# EAGLE design controller-ha-v5 (EAGLE 6.5.0)
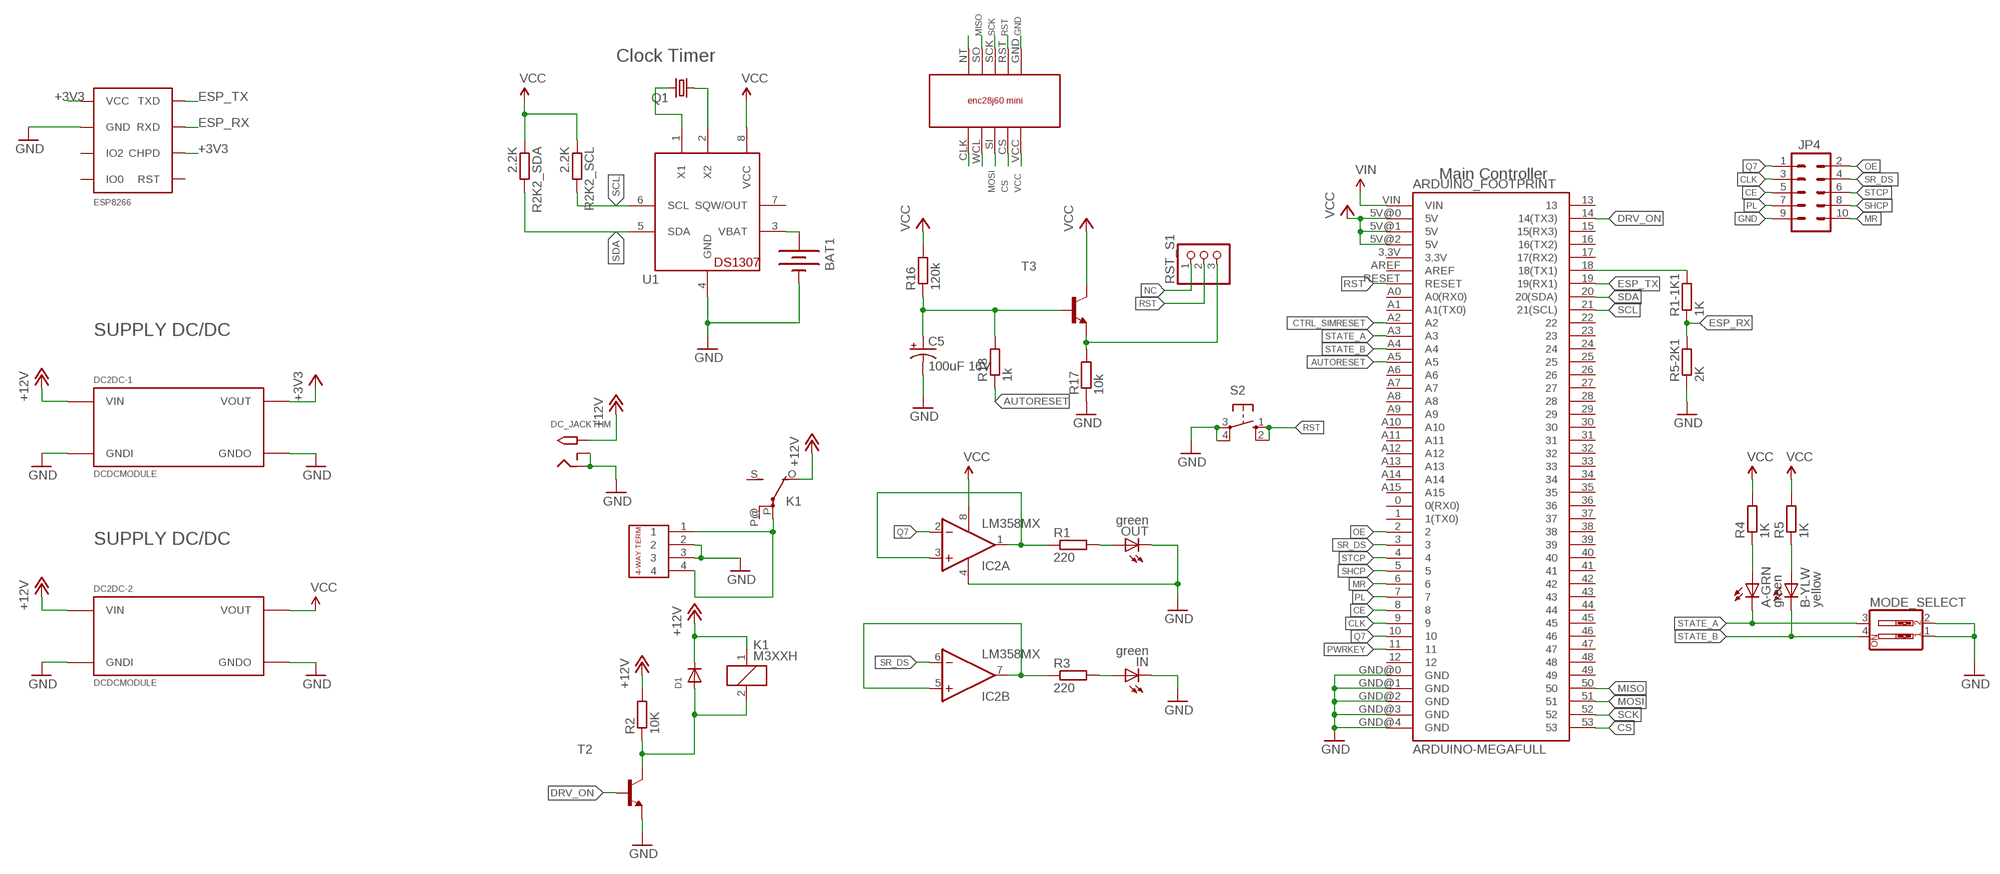
[diagram p0: schematic, sheet 1]

## Parts
4-WAY_L-TERMINAL  4-PIN-CON-1759017  [4-PIN-CON-1759017]
A-GRN  green  LEDCHIP-LED0805  [CHIP-LED0805]
ARDUINO_FOOTPRINT  ARDUINO-MEGAFULL  [ARDUINO_MEGA]
B-YLW  yellow  LEDCHIP-LED0805  [CHIP-LED0805]
BAT1  BATTERY20PTH  [BATTCOM_20MM_PTH]
C5  100uF 16V  CPOL-US153CLV-0605  [153CLV-0605]
D1  DIODESMA  [SMADIODE]
DC2DC-1  DCDCMODULE  [DCDCMODULE]
DC2DC-2  DCDCMODULE  [DCDCMODULE]
DC_JACKTHM  2.1MMJACKTHM  [PJ-102A]
ESP8266  ESP8266  [ESP8266]
IC2  LM358MX  [SO08]
IN  green  LEDCHIPLED_0805  [CHIPLED_0805]
JP4  M05X2RA  [2X5-RA]
K1  M3XXH  [M3XXH]
MODE_SELECT  SW_DIP-2  [EDG-02]
OUT  green  LEDCHIPLED_0805  [CHIPLED_0805]
Q1  CRYSTALTC26H  [TC26H]
R1  220  R-EU_R0805  [R0805]
R1-1K1  1K  R-EU_R0603  [R0603]
R2  10K  R-EU_R0805  [R0805]
R2K2_SCL  2.2K  R-EU_R0603  [R0603]
R2K2_SDA  2.2K  R-EU_R0603  [R0603]
R3  220  R-EU_R0805  [R0805]
R4  1K  R-EU_R0805  [R0805]
R5  1K  R-EU_R0805  [R0805]
R5-2K1  2K  R-EU_R0603  [R0603]
R16  120k  R-EU_R0805  [R0805]
R17  10k  R-EU_R0805  [R0805]
R18  1k  R-EU_R0805  [R0805]
RST_S1  PINHD-1X3CB  [1X03-CLEANBIG]
S2  10-XX  [B3F-10XX]
T2  MMBT2222ALT1-NPN-SOT23-BEC  [SOT23-BEC]
T3  MMBT2222ALT1-NPN-SOT23-BEC  [SOT23-BEC]
U1  DS1307  [DIL08]
U$2  ENC28J60_MODULE_BOTTOM  [ENC28J60_MODULE_BOTTOM]

## Nets
+3V3 [power]: DC2DC-1.VOUT ESP8266.CHPD ESP8266.VCC
+12V [power]: D1.C DC2DC-1.VIN DC2DC-2.VIN DC_JACKTHM.TIP K1.1 K1.O(2:O) R2.2
AUTORESET: ARDUINO_FOOTPRINT.A5 R18.1
CE: ARDUINO_FOOTPRINT.8 JP4.5
CLK: ARDUINO_FOOTPRINT.9 JP4.3
CS: ARDUINO_FOOTPRINT.53 U$2.CS
CTRL_SIMRESET: ARDUINO_FOOTPRINT.A2
DRV_ON: ARDUINO_FOOTPRINT.14(14(TX3)) T2.B
ESP_RX: ESP8266.RXD R1-1K1.1 R5-2K1.2
ESP_TX: ARDUINO_FOOTPRINT.19(19(RX1)) ESP8266.TXD
GND [GND]: 4-WAY_L-TERMINAL.2 4-WAY_L-TERMINAL.3 ARDUINO_FOOTPRINT.GND@0(GND) ARDUINO_FOOTPRINT.GND@1(GND) ARDUINO_FOOTPRINT.GND@2(GND) ARDUINO_FOOTPRINT.GND@3(GND) ARDUINO_FOOTPRINT.GND@4(GND) BAT1.2(-) C5.- DC2DC-1.GND#0(GNDI) DC2DC-1.GND#1(GNDO) DC2DC-2.GND#0(GNDI) DC2DC-2.GND#1(GNDO) DC_JACKTHM.RING DC_JACKTHM.RING_SW ESP8266.GND IC2.4(P:V-) IN.C JP4.9 MODE_SELECT.1 MODE_SELECT.2 OUT.C R5-2K1.1 R17.1 S2.3(P) S2.4(P1) T2.E U1.4(GND) U$2.GND
MISO: ARDUINO_FOOTPRINT.50 U$2.SO
MOSI: ARDUINO_FOOTPRINT.51 U$2.SI
MR: ARDUINO_FOOTPRINT.6 JP4.10
N$1: U$2.CLK
N$2: U$2.WCL
N$3: 4-WAY_L-TERMINAL.1 4-WAY_L-TERMINAL.4 K1.P(2:P)
N$4: D1.A K1.2 R2.1 T2.C
N$5: R17.2 RST_S1.3 T3.E
N$16: Q1.1 U1.2(X2)
N$19: Q1.2 U1.1(X1)
N$20: ARDUINO_FOOTPRINT.18(18(TX1)) R1-1K1.2
N$21: IC2.1(A:OUT) IC2.3(A:+IN) R1.1
N$23: BAT1.1(+) U1.3(VBAT)
N$24: IC2.5(B:+IN) IC2.7(B:OUT) R3.1
N$25: OUT.A R1.2
N$26: IN.A R3.2
N$27: A-GRN.A R4.1
N$28: B-YLW.A R5.1
N$35: U$2.NT
NC: RST_S1.1
NET1: C5.+ R16.1 R18.2 T3.B
OE: ARDUINO_FOOTPRINT.2 JP4.2
PL: ARDUINO_FOOTPRINT.7 JP4.7
PWRKEY: ARDUINO_FOOTPRINT.11
Q7: ARDUINO_FOOTPRINT.10 IC2.2(A:-IN) JP4.1
RST: ARDUINO_FOOTPRINT.RESET RST_S1.2 S2.1(S) S2.2(S1) U$2.RST
SCK: ARDUINO_FOOTPRINT.52 U$2.SCK
SCL: ARDUINO_FOOTPRINT.21(21(SCL)) R2K2_SCL.2 U1.6(SCL)
SDA: ARDUINO_FOOTPRINT.20(20(SDA)) R2K2_SDA.2 U1.5(SDA)
SHCP: ARDUINO_FOOTPRINT.5 JP4.8
SR_DS: ARDUINO_FOOTPRINT.3 IC2.6(B:-IN) JP4.4
STATE_A: A-GRN.C ARDUINO_FOOTPRINT.A3 MODE_SELECT.3
STATE_B: ARDUINO_FOOTPRINT.A4 B-YLW.C MODE_SELECT.4
STCP: ARDUINO_FOOTPRINT.4 JP4.6
VCC [power]: ARDUINO_FOOTPRINT.5V@0(5V) ARDUINO_FOOTPRINT.5V@1(5V) ARDUINO_FOOTPRINT.5V@2(5V) DC2DC-2.VOUT IC2.8(P:V+) R2K2_SCL.1 R2K2_SDA.1 R4.2 R5.2 R16.2 T3.C U1.8(VCC) U$2.VCC
VIN: ARDUINO_FOOTPRINT.VIN
Unconnected: ARDUINO_FOOTPRINT.0(0(RX0)) ARDUINO_FOOTPRINT.1(1(TX0)) ARDUINO_FOOTPRINT.3.3V ARDUINO_FOOTPRINT.12 ARDUINO_FOOTPRINT.13 ARDUINO_FOOTPRINT.15(15(RX3)) ARDUINO_FOOTPRINT.16(16(TX2)) ARDUINO_FOOTPRINT.17(17(RX2)) ARDUINO_FOOTPRINT.22 ARDUINO_FOOTPRINT.23 ARDUINO_FOOTPRINT.24 ARDUINO_FOOTPRINT.25 ARDUINO_FOOTPRINT.26 ARDUINO_FOOTPRINT.27 ARDUINO_FOOTPRINT.28 ARDUINO_FOOTPRINT.29 ARDUINO_FOOTPRINT.30 ARDUINO_FOOTPRINT.31 ARDUINO_FOOTPRINT.32 ARDUINO_FOOTPRINT.33 ARDUINO_FOOTPRINT.34 ARDUINO_FOOTPRINT.35 ARDUINO_FOOTPRINT.36 ARDUINO_FOOTPRINT.37 ARDUINO_FOOTPRINT.38 ARDUINO_FOOTPRINT.39 ARDUINO_FOOTPRINT.40 ARDUINO_FOOTPRINT.41 ARDUINO_FOOTPRINT.42 ARDUINO_FOOTPRINT.43 ARDUINO_FOOTPRINT.44 ARDUINO_FOOTPRINT.45 ARDUINO_FOOTPRINT.46 ARDUINO_FOOTPRINT.47 ARDUINO_FOOTPRINT.48 ARDUINO_FOOTPRINT.49 ARDUINO_FOOTPRINT.A0(A0(RX0)) ARDUINO_FOOTPRINT.A1(A1(TX0)) ARDUINO_FOOTPRINT.A6 ARDUINO_FOOTPRINT.A7 ARDUINO_FOOTPRINT.A8 ARDUINO_FOOTPRINT.A9 ARDUINO_FOOTPRINT.A10 ARDUINO_FOOTPRINT.A11 ARDUINO_FOOTPRINT.A12 ARDUINO_FOOTPRINT.A13 ARDUINO_FOOTPRINT.A14 ARDUINO_FOOTPRINT.A15 ARDUINO_FOOTPRINT.AREF ESP8266.IO0 ESP8266.IO2 ESP8266.RST K1.P@(2:P) K1.S(2:S) U1.7(SQW/OUT)

## Notes on the sheet
- Clock Timer
- Main Controller
- SUPPLY DC/DC
- SUPPLY DC/DC

## Library data of the parts
4-WAY_L-TERMINAL = maul:4-PIN-CON-1759017
A-GRN B-YLW = led:LED: LED
ARDUINO_FOOTPRINT = SparkFun-Boards:ARDUINO-MEGA: Arduino Mega board footprint
BAT1 = SparkFun-Electromechanical:BATTERY: Battery Holders Various common sizes : AA, AAA, 20mm coin cell and 12mm coin cell. 20MM_4LEGS, BATT-10373
C5 = resistor:CPOL-US: POLARIZED CAPACITOR, American symbol
D1 = adafruit:DIODE: Diode SMADIODE - SMA Surface Mount Package 20V 1A Schottky Diode Digikey: 641-1014-6-ND DO-1N4148 - Through Hole Small Current Diode SOD-123 20V 1 A (.5mV Vf) Schottky Diode - Digikey: MBRX120TPMSCT-ND SOD-323 10V 570mA (.38mV Vf, 3ns) Schottky Diode - Digikey: ZLLS410CT-ND SOD-523 30V 30mA Schottky Diode (RB751S-40TE61) - Digikey: RB751S-40TE61CT-ND SOT23-R/W - SOT23 Package (R = Solder Paste/Reflow Ovens, W = Hand-Soldering) BAT54Film 40V 300mA - Digikey: 497-7162-1-ND
DC2DC-1 DC2DC-2 = bontor:DCDCMODULE
DC_JACKTHM = adafruit:2.1MMJACK: 2.1mm x 5.5mm THM DC jack with internal switch. Digikey part #PJ-102A, 4UCON part #05537 2.1mm x 5.5mm SMT DC jack with internal switch. Digikey part #PJ-002A-SMT, 4UCON part #03267 By microbuilder.eu & adafruit.com
ESP8266 = tigorcustom:ESP8266
IC2 = linear:LM358: OP AMP also LM158; LM258; LM2904 Source: http://cache.national.com/ds/LM/LM158.pdf
IN OUT = adafruit:LED: LED
JP4 = SparkFun-Connectors:M05X2: Header 5x2 Standard 10-pin dual row 0.1" header. Commonly used with AVR-ISP. Use with Spark Fun Electronics SKU: PRT-00778
K1 = relay:M3XXH: RELAY 1 x switch; OC_FARNELL: unknown; OC_NEWARK: unknown
MODE_SELECT = special:SW_DIP-2: DIP SWITCH
Q1 = crystal:CRYSTAL: CRYSTAL; OC_FARNELL: unknown; OC_NEWARK: unknown
R1-R5 = resistor:R-EU_: RESISTOR, European symbol
R1-1K1 R2K2_SCL R2K2_SDA R5-2K1 R16-R18 = rcl:R-EU_: RESISTOR, European symbol
RST_S1 = adafruit:PINHD-1X3: PIN HEADER
S2 = switch-omron:10-XX: OMRON SWITCH; MPN: B3F-1000; OC_FARNELL: 176432; OC_NEWARK: 36M3542
T2 T3 = transistor:*-NPN-: NPN Transistror BF959 corrected 2008.03.06
U1 = adafruit:DS1307: DS1307 Real time clock (RTC) with battery backup ability. Talk to it via i2c
U$2 = maul:ENC28J60_MODULE_BOTTOM

## Net classes
0 default: width 0.305 mm, drill 0.015 mm, clearance 0.508 mm
1 power: width 0.305 mm, drill 0.6 mm, clearance 0.813 mm
2 GND: width 0.305 mm, drill 0.6 mm, clearance 0.508 mm
3 LIVEAC: width 0.508 mm, drill 0.508 mm, clearance 1.27 mm

## Board
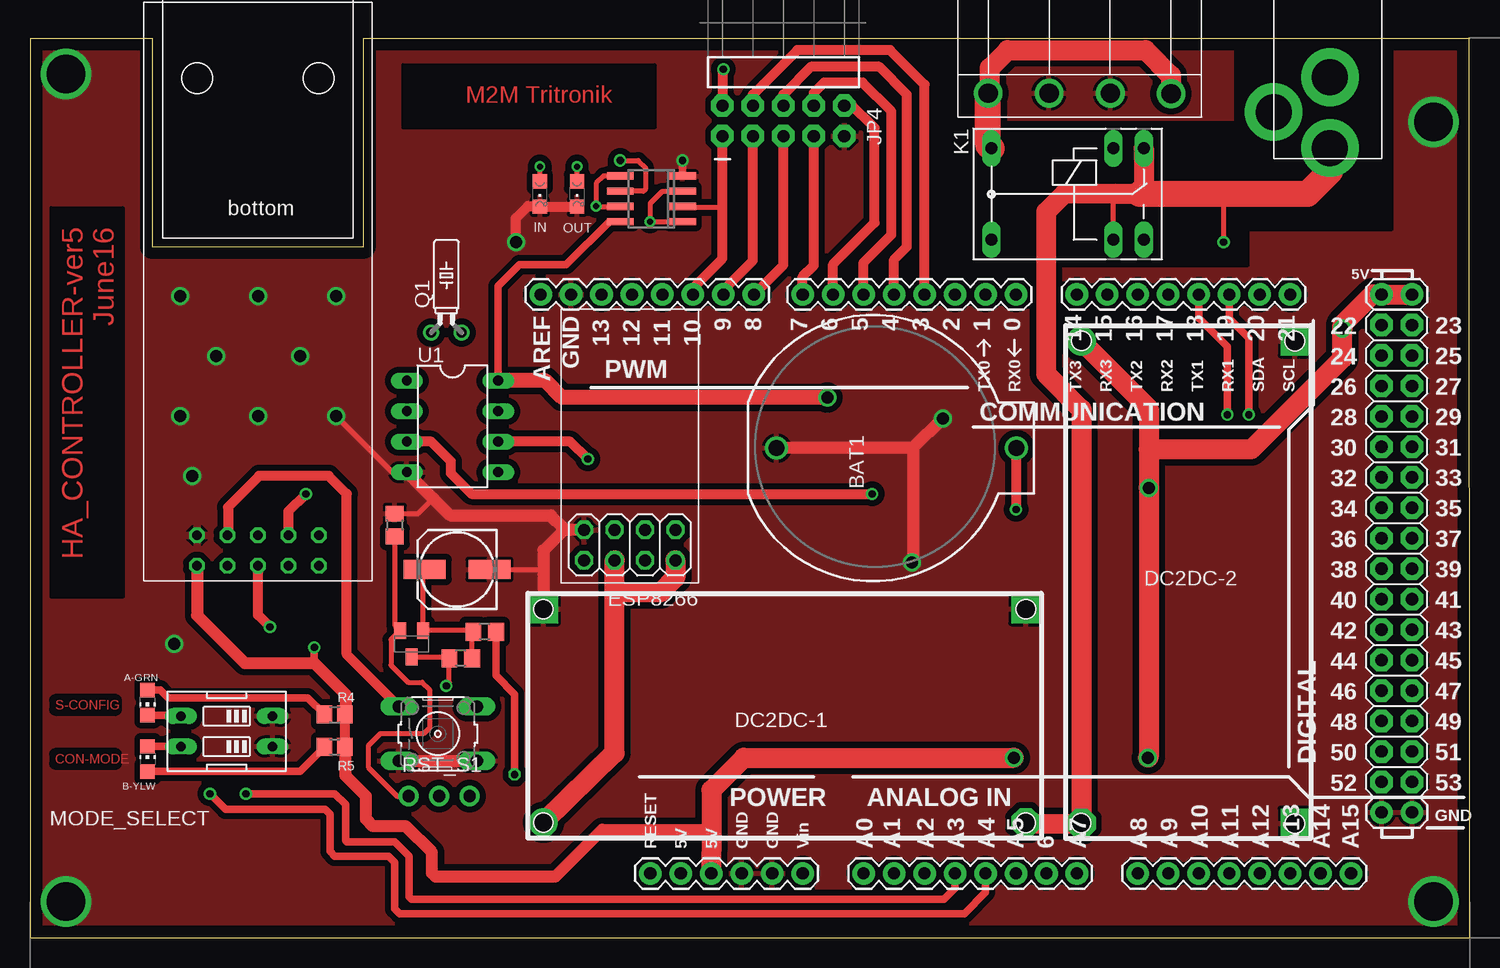
[diagram p1: board, top side]
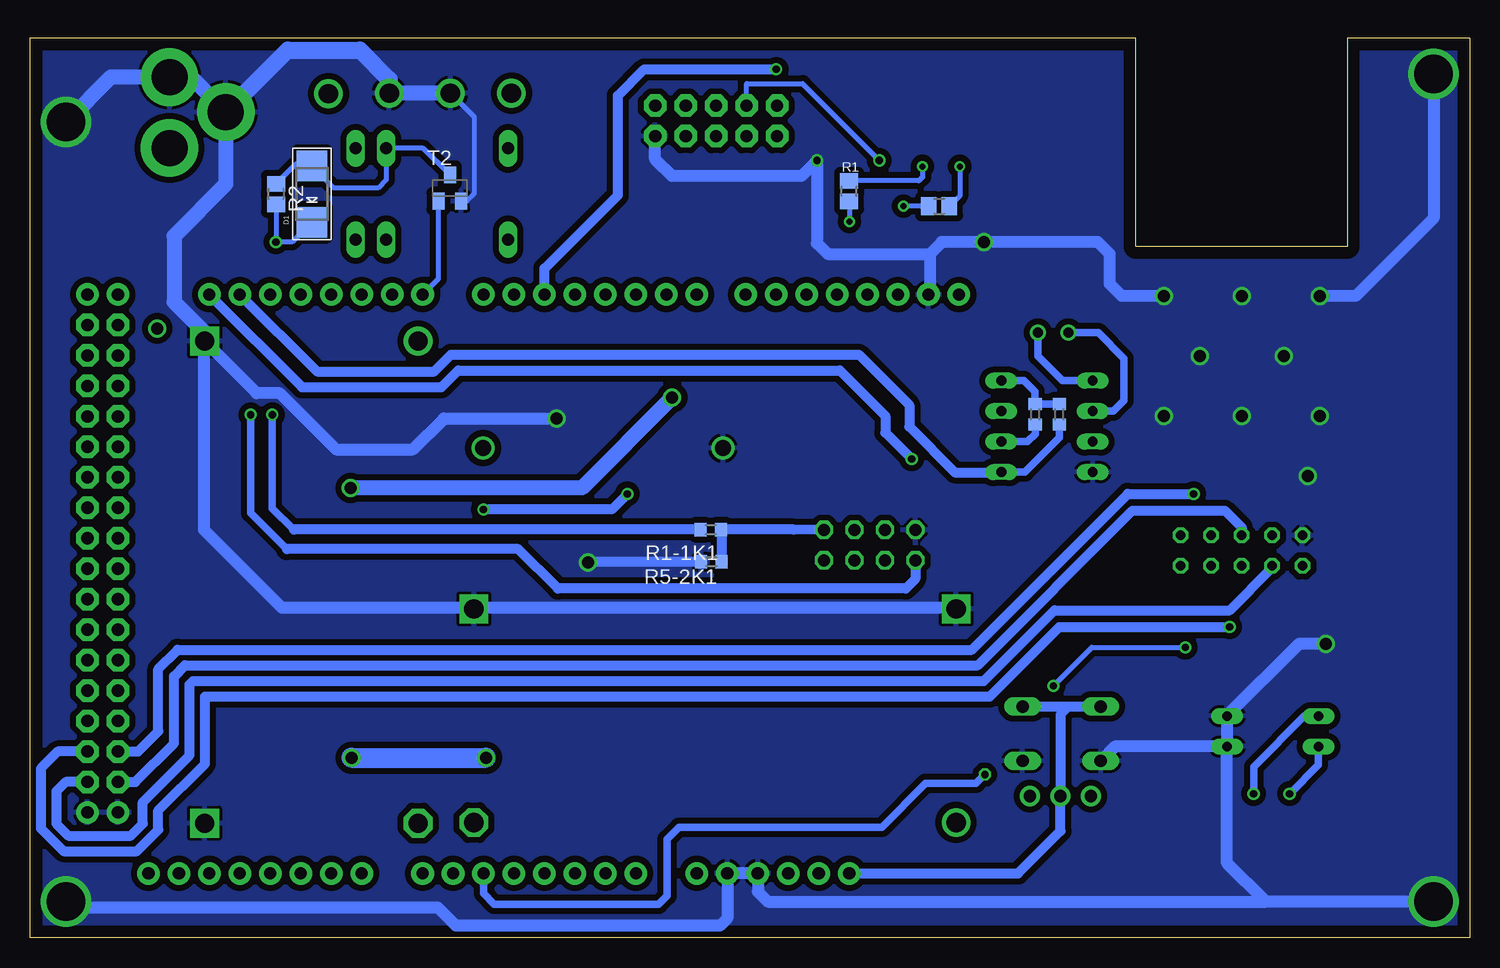
[diagram p2: board, bottom side, seen from below]

Size 120 x 75.01 mm. Coordinates in mm from the lower left corner, seen from the top.
Outline: 119.98,75.01 120,0 0,0 0,75 10.2,75 10.2,57.6 27.8,57.6 27.8,75 120,75
Copper layers (1*16): Top 0.035mm / dielectric 1.5mm / Bottom 0.035mm
Design rules "default": minimum track width 10mil, minimum drill 24mil, track to track 8mil, track to pad 8mil, pad to pad 8mil, via to via 8mil, smd to smd 8mil, copper to edge 40mil, drill to drill 8mil, minimum pad ring 10mil, minimum via ring 8mil, stop-mask expansion 4mil, vias tented up to drill 0mil, thermal gap 10mil

### Footprints (pad centres in the part's own frame; a part is rotated, then mirrored left to right if it is on the bottom)
4-PIN-CON-1759017 = drill 1.6: 1 -7.62,4.13; 2 -2.55,4.1; 3 2.55,4.1; 4 7.63,4.1
CHIP-LED0805 = smd 1.2 x 1.2: A 0,-1.05; C 0,1.05
ARDUINO_MEGA = drill 1.016 pad 1.88: 0 8.89,24.13; 1 6.35,24.13; 2 3.81,24.13; 3 1.27,24.13; 3.3V -19.05,-24.13; 4 -1.27,24.13; 5 -3.81,24.13; 5V@0 -16.51,-24.13; 5V@1 39.37,24.13; 5V@2 41.91,24.13; 6 -6.35,24.13; 7 -8.89,24.13; 8 -12.954,24.13; 9 -15.494,24.13; 10 -18.034,24.13; 11 -20.574,24.13; 12 -23.114,24.13; 13 -25.654,24.13; 14 13.97,24.13; 15 16.51,24.13; 16 19.05,24.13; 17 21.59,24.13; 18 24.13,24.13; 19 26.67,24.13; 20 29.21,24.13; 21 31.75,24.13; A0 -3.81,-24.13; A1 -1.27,-24.13; A2 1.27,-24.13; A3 3.81,-24.13; A4 6.35,-24.13; A5 8.89,-24.13; A6 11.43,-24.13; A7 13.97,-24.13; A8 19.05,-24.13; A9 21.59,-24.13; A10 24.13,-24.13; A11 26.67,-24.13; A12 29.21,-24.13; A13 31.75,-24.13; A14 34.29,-24.13; A15 36.83,-24.13; AREF -30.734,24.13; GND@0 -13.97,-24.13; GND@1 -11.43,-24.13; GND@2 39.37,-19.05; GND@3 41.91,-19.05; GND@4 -28.194,24.13; RESET -21.59,-24.13; VIN -8.89,-24.13 | drill 1.016 pad 1.88 octagon: 22 39.37,21.59; 23 41.91,21.59; 24 39.37,19.05; 25 41.91,19.05; 26 39.37,16.51; 27 41.91,16.51; 28 39.37,13.97; 29 41.91,13.97; 30 39.37,11.43; 31 41.91,11.43; 32 39.37,8.89; 33 41.91,8.89; 34 39.37,6.35; 35 41.91,6.35; 36 39.37,3.81; 37 41.91,3.81; 38 39.37,1.27; 39 41.91,1.27; 40 39.37,-1.27; 41 41.91,-1.27; 42 39.37,-3.81; 43 41.91,-3.81; 44 39.37,-6.35; 45 41.91,-6.35; 46 39.37,-8.89; 47 41.91,-8.89; 48 39.37,-11.43; 49 41.91,-11.43; 50 39.37,-13.97; 51 41.91,-13.97; 52 39.37,-16.51; 53 41.91,-16.51
BATTCOM_20MM_PTH = drill 1.3: 1 11.85,0; 2 -8.15,0
153CLV-0605 = smd 3.5 x 1.6: + 2.7,0; - -2.7,0
SMADIODE = smd 2.54 x 2.54: A 2.349,0; C -2.349,0
DCDCMODULE = drill 1.6 square: GND#0 -20.08,-8.82; GND#1 20.12,-8.82 | drill 1.6 octagon: VIN -20.08,8.98 | drill 1.6: VOUT 20.12,8.98
PJ-102A = drill 3 pad 4.8: RING 0.1,-3.39; RING_SW -4.6,-6.29; TIP 0.1,-9.29
ESP8266 = drill 1.016 octagon: CHPD 1.27,1.27; GND 3.81,-1.27; IO0 -1.27,-1.27; IO2 1.27,-1.27; RST -1.27,1.27; RXD -3.81,-1.27; TXD 3.81,1.27; VCC -3.81,1.27
SO08 = smd 0.6 x 2.2: 1 -1.905,-2.6; 2 -0.635,-2.6; 3 0.635,-2.6; 4 1.905,-2.6; 5 1.905,2.6; 6 0.635,2.6; 7 -0.635,2.6; 8 -1.905,2.6
CHIPLED_0805 = smd 1.2 x 1.2: A 0,-1.05; C 0,1.05
2X5-RA = drill 1.016 pad 1.88 octagon: 1 -1.27,5.08; 2 1.27,5.08; 3 -1.27,2.54; 4 1.27,2.54; 5 -1.27,0; 6 1.27,0; 7 -1.27,-2.54; 8 1.27,-2.54; 9 -1.27,-5.08; 10 1.27,-5.08
M3XXH = drill 1.016 long: 1 -3.81,3.81; 2 -3.81,-3.81; O -6.35,-3.81; P 6.35,-3.81; P@ 6.35,3.81; S -6.35,3.81
EDG-02 = drill 0.813 long: 1 -1.27,-3.81; 2 1.27,-3.81; 3 1.27,3.81; 4 -1.27,3.81
TC26H = drill 0.813: 1 -1.27,0; 2 1.27,0
R0805 = smd 1.3 x 1.5: 1 -0.85,0; 2 0.85,0
R0603 = smd 1 x 1.1: 1 -0.85,0; 2 0.85,0
R0805' = smd 1.3 x 1.5: 1 -0.95,0; 2 0.95,0
1X03-CLEANBIG = drill 1.016 pad 1.676: 1 -2.54,0; 2 0,0; 3 2.54,0
B3F-10XX = drill 1.016 long: 1 -3.251,2.261; 2 3.251,2.261; 3 -3.251,-2.261; 4 3.251,-2.261
SOT23-BEC = smd 1 x 1.4: B -0.95,-1.1; C 0,1.1; E 0.95,-1.1
DIL08 = drill 0.813 long: 1 -3.81,-3.81; 2 -1.27,-3.81; 3 1.27,-3.81; 4 3.81,-3.81; 5 3.81,3.81; 6 1.27,3.81; 7 -1.27,3.81; 8 -3.81,3.81
ENC28J60_MODULE_BOTTOM = drill 0.8 octagon: CLK 5.08,0; CS -2.54,0; GND -5.08,2.54; NT 5.08,2.54; RST -2.54,2.54; SCK 0,2.54; SI 0,0; SO 2.54,2.54; VCC -5.08,0; WCL 2.54,0

### Placement (x,y rotation side)
4-WAY_L-TERMINAL  87.5,74.5 180 top
A-GRN  9.8,19.6 180 top
ARDUINO_FOOTPRINT  73.3,29.49 0 top
B-YLW  9.8,14.9 0 top
BAT1  70.38,40.82 0 top
C5  35.6,30.7 180 top
D1  96.5,62 90 bottom
DC2DC-1  62.92,18.58 180 top
DC2DC-2  96.63,29.62 90 top
DC_JACKTHM  108.27,75.13 0 top
ESP8266  50,32.73 180 top
IC2  51.8,61.6 90 top
IN  42.5,62 180 top
JP4  62.8,68.1 90 top
K1  86.5,62 180 top
MODE_SELECT  16.4,17.2 90 top
OUT  45.6,62 180 top
Q1  34.71,50.44 0 top
R1  51.72,62.24 90 bottom
R1-1K1  63.25,34.01 180 bottom
R2  99.5,62 270 bottom
R2K2_SCL  36.21,43.63 270 bottom
R2K2_SDA  34.19,43.63 270 bottom
R3  44.22,60.97 0 bottom
R4  25.4,18.6 0 top
R5  25.4,15.9 0 top
R5-2K1  63.2,31.34 0 bottom
R16  120k  [R0805']  35.9,23.3 180 top
R17  10k  [R0805']  30.4,34.4 270 top
R18  1k  [R0805']  37.9,25.5 180 top
RST_S1  34.1,11.8 180 top
S2  34,17 0 top
T2  85,62.5 0 bottom
T3  31.8,24.5 180 top
U1  35.22,42.63 270 top
U$2  19,31 0 top

### Tracks (layer width: path | path; a pad name or v marks a point on that pad's centre or on a via)
+3V3
  Top 1.676: DC2DC-1.VOUT 48.73,15.39 48.73,28.8 | 48.73,28.8 ESP8266.CHPD | ESP8266.VCC 53.81,30.01 52.6,28.8 48.73,28.8
+12V  (via drill 0.6)
  Top 0.406: K1.1 90.31,61.82 90.5,62.01 | v99.5,58 99.5,62.02
  Top 1.676: DC2DC-1.VIN 83.2,9.5 DC2DC-2.VIN 87.66,44.05 84.7,47.01 84.7,60.5 86.2,62.01 90.5,62.01 92.5,62.01 92.5,62.02 92.85,62.37 K1.O
  Top 2.184: 92.5,62.02 99.5,62.02 106.52,62.02 108.37,63.87 DC_JACKTHM.TIP
  Bottom 0.406: R2.2 v99.5,58 98.15,58 D1.C
AUTORESET  (via drill 0.6)
  Top 0.61: R18.1 38.86,21.86 40.4,20.3 v40.4,13.6
  Bottom 0.61: ARDUINO_FOOTPRINT.A5 82.19,3.69 81.3,2.8 67.6,2.8 66.9,3.5 66.9,8.2 65.9,9.2 49,9.2 45.34,12.86 41.14,12.86 v40.4,13.6
CE
  Top 0.813: ARDUINO_FOOTPRINT.8 62.8,56.07 JP4.5
CLK
  Top 0.813: ARDUINO_FOOTPRINT.9 57.81,54.01 60.26,56.46 JP4.3
CS
  Bottom 0.813: ARDUINO_FOOTPRINT.53 117.02,12.98 117.8,12.2 117.8,9.5 116.8,8.5 111.6,8.5 110.6,9.5 110.6,11.3 106.7,15.2 106.7,21.1 106.4,21.4 40.5,21.4 34.6,27.3 20,27.3 16.46,30.84 U$2.CS
DRV_ON
  Bottom 0.406: ARDUINO_FOOTPRINT.14 85.95,54.94 T2.B
ESP_RX
  Bottom 0.813: ESP8266.RXD 56.32,34.01 R1-1K1.1 62.35,33.96 R5-2K1.2
ESP_TX  (via drill 0.6)
  Top 0.61: v101.6,43.6 101.6,50 99.97,51.63 ARDUINO_FOOTPRINT.19
  Bottom 0.61: 98.6,32.4 101.6,35.4 v101.6,43.6
  Bottom 0.813: 98.6,32.4 79.3,32.4 76,29.1 47,29.1 46.19,29.91 ESP8266.TXD
GND  (via drill 0.6, 1, 3.2)
  Top 0.406: IC2.4 | R17.1 32.35,35.35 33.62,36.62 | C5.- 42.4,30.7 42.8,30.3 | U1.4 30.18,38.82 v25.5,43.5
  Top 0.61: IC2.4 v54.4,64.8
  Top 0.813: OUT.C IN.C 42.45,61 41.5,61 40.5,60 v40.5,58
  Top 1.016: ESP8266.GND 44.5,34 | 44.5,34 42.8,32.3 42.8,30.3 DC2DC-1.GND#1 | S2.3 S2.4 | v76.1,43.3 73.62,40.82 | 73.62,40.82 BAT1.2 | 73.62,40.82 73.6,40.8 | 73.6,40.8 73.54,40.74 | 73.6,40.8 73.6,31.4 v73.5,31.3 | U1.4 33.62,36.62 35.03,35.2 43.4,35.2 44.5,34.1 44.5,34
  Bottom 0.406: 4-WAY_L-TERMINAL.3 83,68.45 83,62 83.6,61.4 T2.E
  Bottom 0.813: R5-2K1.1 73.46,31.34 v73.5,31.3
  Bottom 1.016: v3,72 3,60 9.5,53.5 v12.5,53.5 | v25.5,53.5 29,53.5 30,54.5 30,57 31,58 v40.5,58 44,58 45,57 | 45,57 45,53.73 ARDUINO_FOOTPRINT.GND@4 | 45,57 53.5,57 54.4,57.9 v54.4,64.8 55.7,63.5 66.5,63.5 67.88,64.88 JP4.9 | DC2DC-1.GND#1 42.9,27.5 82.9,27.5 | 82.9,27.5 DC2DC-1.GND#0 | v3,3 17,3 | 17,3 20.21,6.21 MODE_SELECT.1 | v12,24.5 14.18,24.5 MODE_SELECT.2 MODE_SELECT.1 | MODE_SELECT.1 29.56,15.93 S2.3 | 17,3 58.5,3 59.33,3.83 ARDUINO_FOOTPRINT.GND@0 ARDUINO_FOOTPRINT.GND@1 61.87,1.63 62.5,1 84.5,1 86,2.5 116.5,2.5 v117,3 | 82.9,27.5 99,27.5 105.5,34 105.5,49.69 DC2DC-2.GND#1 101.11,45.4 99.2,45.4 94.5,40.7 88.1,40.7 85.5,43.3 v76.1,43.3
  Bottom 1.27: 4-WAY_L-TERMINAL.3 4-WAY_L-TERMINAL.2 | v117,68 113.26,71.74 DC_JACKTHM.RING 106.57,71.74 DC_JACKTHM.RING_SW 103.67,62.83 108,58.5 108,53 105.45,50.45 DC2DC-2.GND#1
  Bottom 1.422: DC_JACKTHM.RING_SW 98.51,74 92.5,74 90.05,71.55 4-WAY_L-TERMINAL.2
  other vias: 19,53.5 22.5,48.5 15.5,48.5 12.5,43.5 19,43.5 13.5,38.5
  pour Top: 9.5,57 28.5,57 28.5,30 28.5,22 10,22 9.5,22
  pour Top: 102,12 109,12 109,16.5 120,16.5 120,0 102,0
  pour Bottom: 0,75 120,75 120,0 0,0
  pour Top: 0,75 120,75 120,0 0,0
MISO  (via drill 0.6)
  Top 0.813: v23,37 21.54,35.54 U$2.SO
  Bottom 0.813: ARDUINO_FOOTPRINT.50 110.98,15.52 109.3,17.2 109.3,22.4 107.7,24 41.5,24 28.5,37 v23,37
MOSI  (via drill 0.6)
  Top 0.813: v20,25.9 19,26.9 U$2.SI
  Bottom 0.813: ARDUINO_FOOTPRINT.51 117.68,15.52 119.1,14.1 119.1,9.1 117.2,7.2 111.1,7.2 109.3,9 109.3,10.6 105.4,14.5 105.4,20.1 40,20.1 34.2,25.9 v20,25.9
MR
  Top 0.813: JP4.10 68.53,69.37 70.25,67.65 70.4,67.5 70.4,59.6 66.95,56.15 ARDUINO_FOOTPRINT.6
N$3
  Top 1.676: 4-WAY_L-TERMINAL.4 80,70.53 80,72.5 81.5,74 93,74 95.12,71.88 4-WAY_L-TERMINAL.1
  Top 2.184: K1.P 79.87,66.09 4-WAY_L-TERMINAL.4
N$4
  Bottom 0.406: T2.C 87.21,65.81 K1.2 90.31,63.19 91,62.5 94.65,62.5 D1.A 96.15,64.35 96,64.5 97.85,64.5 R2.1
N$5
  Top 0.406: R17.2 30.4,26.05 T3.E 30.1,24.85 30.1,22.7 31.5,21.3 32.7,21.3 33.3,20.7 33.3,17.5 32.8,17 29.2,17 28.2,16 28.2,14.2 30.6,11.8 RST_S1.3
N$6
  cutout Top: 31.1,72.8 52.1,72.8 52.1,67.5 31.1,67.5
N$8
  cutout Top: 77.5,68 100.5,68 100.5,75 113.5,75 113.5,59 101.5,59 101.5,56 77.5,56
N$16
  Bottom 0.61: Q1.1 30.94,50.44 28.8,48.3 28.8,44.8 29.7,43.9 U1.2
N$19
  Bottom 0.61: Q1.2 35.98,48.48 33.94,46.44 U1.1
N$20  (via drill 0.6)
  Top 0.61: v99.8,43.6 99.8,49.3 97.43,51.67 ARDUINO_FOOTPRINT.18
  Bottom 0.61: 98.01,34.01 99.8,35.8 v99.8,43.6
  Bottom 0.813: R1-1K1.2 98.01,34.01
N$21  (via drill 0.5)
  Top 0.406: IC2.1 v51.7,59.7 51.7,61.2 52.7,62.2 54.37,62.2 IC2.3
  Bottom 0.406: R1.1 51.7,61.37 v51.7,59.7
N$22
  cutout Top: 7.75,28.37 1.75,28.37 1.75,60.87 7.75,60.87
N$23  (via drill 0.6)
  Top 0.813: U1.3 33.44,41.36 35.1,39.7 35.1,38.7 36.8,37 v70.2,37 | v82.2,35.7 82.23,35.73 BAT1.1
  Bottom 0.813: v70.2,37 71.5,35.7 v82.2,35.7
N$24  (via drill 0.5)
  Top 0.406: IC2.7 47.23,60.97 v47.2,61 47.2,62.9 47.8,63.51 IC2.5
  Bottom 0.406: R3.1 45.1,61 v47.2,61
N$25  (via drill 0.5)
  Top 0.406: OUT.A v45.6,64.3
  Bottom 0.406: v45.6,64.3 45.6,63.4 45.9,63.1 R1.2
N$26  (via drill 0.5)
  Top 0.406: IN.A v42.5,64.3
  Bottom 0.406: v42.5,64.3 42.5,61.84 R3.2
N$27
  Top 0.61: A-GRN.A 10.85,20.65 11.5,20 23.15,20 R4.1
N$28
  Top 0.61: B-YLW.A 22.5,13.85 R5.1
NET1
  Top 0.406: C5.+ 32.75,30.55 T3.B 37.25,25.6 R18.2 36.85,25.4 R16.1
OE  (via drill 0.6)
  Top 0.813: v57.8,72.4 57.72,72.32 JP4.2
  Bottom 0.813: ARDUINO_FOOTPRINT.2 77.11,55.79 71,61.9 71,70.2 68.8,72.4 v57.8,72.4
PL
  Top 0.813: ARDUINO_FOOTPRINT.7 64.41,55.11 65.34,56.04 JP4.7
Q7
  Top 0.406: IC2.2 54.47,60.9 57.72,60.9
  Top 0.813: ARDUINO_FOOTPRINT.10 55.27,54.17 57.72,56.62 57.72,60.9 JP4.1
RST
  Top 0.813: U$2.RST 16.5,33.58 16.5,35.9 19.1,38.5 24.9,38.5 26.4,37 26.4,23.61 S2.1
  Bottom 0.813: ARDUINO_FOOTPRINT.RESET 37.64,5.36 34.1,8.9 RST_S1.2 34.1,18.6 33.44,19.26 | 33.44,19.26 S2.1 | S2.2 33.44,19.26
SCK
  Bottom 0.813: ARDUINO_FOOTPRINT.52 111.22,12.98 108,16.2 108,21.8 107.1,22.7 41,22.7 28.1,35.6 20.4,35.6 19,34.2 U$2.SCK
SCL  (via drill 0.6)
  Top 0.813: v46.5,39.9 45.04,41.36 U1.6
  Bottom 0.61: U1.6 36.84,41.36 36.2,42 R2K2_SCL.2
  Bottom 0.813: ARDUINO_FOOTPRINT.21 97.32,45.9 85.7,45.9 84.3,47.3 52.5,47.3 48.7,43.5 48.7,42.1 v46.5,39.9
SDA
  Bottom 0.61: R2K2_SDA.2 34.2,41.7 37.08,38.82 U1.5
  Bottom 0.813: ARDUINO_FOOTPRINT.20 96.08,47.2 86.3,47.2 84.9,48.6 50.9,48.6 46.7,44.4 46.7,42.6 42.9,38.8 39.05,38.8 U1.5
SHCP
  Top 0.813: 65.34,69.44 JP4.8 65.34,70.44 66.2,71.3 69.4,71.3 71.8,68.9 71.8,58.6 69.49,56.29 ARDUINO_FOOTPRINT.5
SR_DS  (via drill 0.6)
  Top 0.406: v49.2,64.8 50.7,64.8 51.3,64.2 51.3,62.4 51.13,62.23 IC2.6
  Top 0.813: JP4.4 60.26,70.3 63.96,74 71.7,74 74.57,71.13 ARDUINO_FOOTPRINT.3
  Bottom 0.406: JP4.4 60.26,71.2 55.6,71.2 v49.2,64.8
STATE_A  (via drill 0.6)
  Top 0.61: ARDUINO_FOOTPRINT.A3 77.12,4.12 76.2,3.2 31.8,3.2 31.6,3.4 31.6,6.8 30.4,8 26.4,8 26.3,8.1 26.3,11.1 25.4,12 v18,12 | A-GRN.C 12.51,18.55 MODE_SELECT.3
  Bottom 0.61: MODE_SELECT.3 13.77,18.47 18,14.24 v18,12
STATE_B  (via drill 0.6)
  Top 0.61: ARDUINO_FOOTPRINT.A4 79.66,3.76 77.9,2 30.8,2 30.4,2.4 30.4,6.3 29.9,6.8 25.4,6.8 25,7.2 25,10.3 24.6,10.7 16.3,10.7 v15,12 | B-YLW.C 12.57,15.95 MODE_SELECT.4
  Bottom 0.61: MODE_SELECT.4 12.59,14.41 v15,12
STCP
  Top 0.813: JP4.6 62.8,70.3 65.1,72.6 70.8,72.6 73.1,70.3 73.1,57.6 72.03,56.53 ARDUINO_FOOTPRINT.4
TRITRONIK1
  cutout Top: 34.4,71.9 33,71.6 33.3,70.6 arc90 32.4,69.7 32.4,69.4 33.2,70.3 33.4,70.3 34,68.6 34.3,70.4 35.1,70.5 35.1,70.7 34.3,70.6
VCC  (via drill 0.6, 1)
  Top 0.406: T3.C 34.8,23.4 R16.2 34.95,21.25 v34.7,21
  Top 0.61: IC2.8 48.3,59.7 44.7,56.1 40.8,56.1 39.03,54.33 U1.8 | v23.7,24.2 23.7,23.2 23.4,22.9
  Top 0.813: R5.2 R4.2
  Top 1.016: U$2.VCC 13.92,26.88 17.9,22.9 23.4,22.9 23.7,22.9 26.3,20.3 26.3,18.65 R4.2 | R5.2 26.3,15.85 26.3,13.5 28,11.8 28,9.9 28.6,9.3 31.3,9.3 33.5,7.1 33.5,5.4 33.8,5.1 43.8,5.1 47.7,9 56.8,9
  Top 1.27: v66.46,45.04 44.36,45.04 42.96,46.44 U1.8
  Top 1.676: ARDUINO_FOOTPRINT.5V@0 56.8,9 56.8,12.3 59.5,15 v82,15 | DC2DC-2.VOUT 93.26,44.1 93.26,40.7 | ARDUINO_FOOTPRINT.5V@2 ARDUINO_FOOTPRINT.5V@1 111.94,53.64 109.4,51.1 v109.4,50.8 109.4,48.3 101.8,40.7 93.26,40.7 | 93.26,40.7 v93.26,37.5 93.26,15.06 v93.2,15
  Bottom 0.406: v34.7,21 31.5,24.2 v23.7,24.2
  Bottom 0.61: U1.8 37.14,46.44 36.21,45.51 R2K2_SCL.1 R2K2_SDA.1
  Bottom 1.27: v93.26,37.5 74,37.5 v66.46,45.04
  Bottom 1.676: v93.2,15 v82,15

### Text on the board
Top: M2M Tritronik | HA_CONTROLLER-ver5 | June16 | S-CONFIG | CON-MODE